# EAGLE design rev1 (EAGLE 9.3.0)
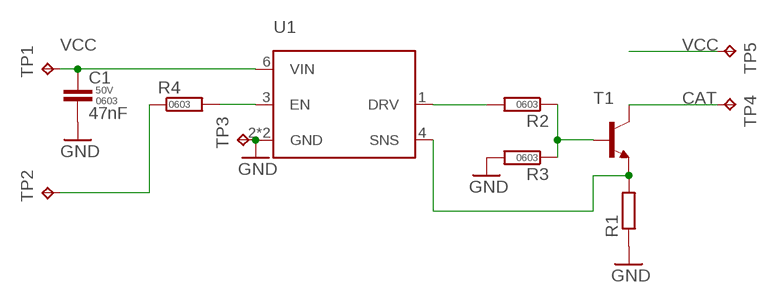
[diagram p0: schematic, sheet 1]

## Parts
C1  47nF  CAP-0603  [C0603]
R1  R-EU_R1206  [R1206]
R2  RES-0603  [R0603]
R3  RES-0603  [R0603]
R4  RES-0603  [R0603]
T1  BC868-NPN-SOT89-BCE  [SOT89-BCE]
TP1  TPB2,54  [B2,54]
TP2  TPB2,54  [B2,54]
TP3  TPB2,54  [B2,54]
TP4  TPB2,54  [B2,54]
TP5  TPB2,54  [B2,54]
U1  BCR450  [SC74_INFINEON]

## Nets
CAT: T1.C TP4.TP
GND: C1.2 R1.1 R3.2 TP3.TP U1.2(GND) U1.5(GND)
N$1: R1.2 T1.E U1.4(SNS)
N$2: R2.2 U1.1(DRV)
N$3: R4.2 U1.3(EN)
N$4: R2.1 R3.1 T1.B
N$5: R4.1 TP2.TP
VCC: C1.1 TP1.TP TP5.TP U1.6(VIN)

## Library data of the parts
C1 = parts-passives:CAP-; PACKAGE: 0603; RATING: 50V
R1 = rcl:R-EU_: RESISTOR, European symbol; SPICEPREFIX: R
R2-R4 = parts-passives:RES-; PACKAGE: 0603
T1 = transistor:*-NPN-: NPN Transistror BF959 corrected 2008.03.06
TP1-TP5 = testpad:TP: Test pad
U1 = parts-infineon:BCR450

## Board
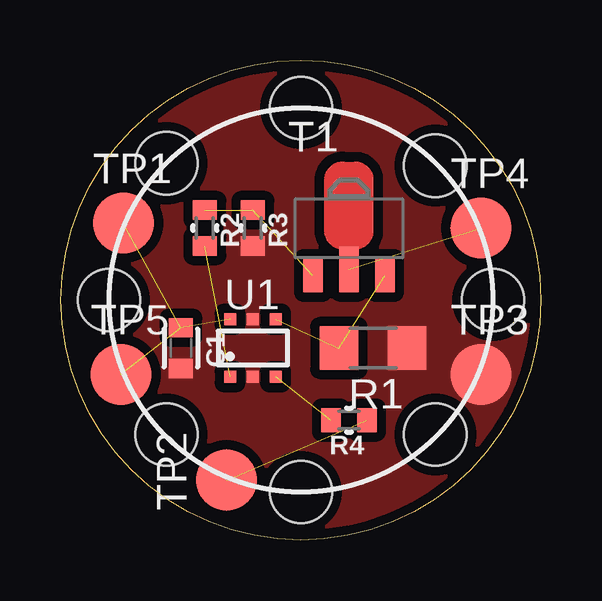
[diagram p1: board, top side]

Size 20 x 20 mm. Coordinates in mm from the lower left corner, seen from the top.
Outline: 0,10 arc-180 20,10 arc-180 0,10
Copper layers (1*16): Top 0.035mm / dielectric 0.9mm / Bottom 0.035mm
Design rules "default *": minimum track width 6mil, minimum drill 0.35mm, track to track 6mil, track to pad 6mil, pad to pad 6mil, via to via 6mil, smd to smd 6mil, copper to edge 0.4mm, drill to drill 6mil, minimum pad ring 10mil, minimum via ring 8mil, stop-mask expansion 4mil, vias tented up to drill 0mil, thermal gap 10mil
Holes 2.6 mm at 2,10 10,18 18,10 10,2 4.4,4.4 4.4,15.7 15.6,15.6 15.6,4.4

### Footprints (pad centres in the part's own frame; a part is rotated, then mirrored left to right if it is on the bottom)
C0603 = smd 0.8 x 1: 1 -0.85,0; 2 0.85,0
R1206 = smd 1.6 x 1.803: 1 -1.422,0; 2 1.422,0
R0603 = smd 0.8 x 1: 1 -0.75,0; 2 0.75,0
SOT89-BCE = smd 0.8 x 1.4: B -1.499,-1.981; E 1.499,-1.981 | smd 0.8 x 1.9: C 0,-1.727
B2,54 = smd 2.54 x 2.54: TP 0,0
SC74_INFINEON = smd 0.5 x 0.5: 1 -0.95,-1.2; 2 0,-1.2; 3 0.95,-1.2; 4 0.95,1.2; 5 0,1.2; 6 -0.95,1.2

### Placement (x,y rotation side)
C1  5,8 270 top
R1  13,8 180 top
R2  6,13 270 top
R3  8,13 270 top
R4  12,5 180 top
T1  12,13 0 top
TP1  2.6,13.2 0 top
TP2  6.9,2.5 90 top
TP3  17.5,6.9 0 top
TP4  17.5,13 0 top
TP5  2.5,6.9 0 top
U1  8,8 0 top

### Tracks (layer width: path | path; a pad name or v marks a point on that pad's centre or on a via)
CAT  (1 unrouted)
GND
  pour Top (isolate 0.4, no thermals): 0,0 0,20 20,20 20,0
N$1  (2 unrouted)
N$2  (1 unrouted)
N$3  (1 unrouted)
N$4  (2 unrouted)
N$5  (1 unrouted)
VCC  (3 unrouted)